# EAGLE design gateway_r0 (EAGLE 8.1.1)
DESCRIPTION: microOBD 200 OBD-II Module; HW_REV: 1.4; PCB_REV: C; PCB_SPEC1: Layer Count: 4; PCB_SPEC2: Size: 1.3" x 0.59"; PCB_SPEC3: Finish Thickness: 0.049" - 0.052"; PCB_SPEC4: Copper Weight: 1oz; TITLE: STM1120
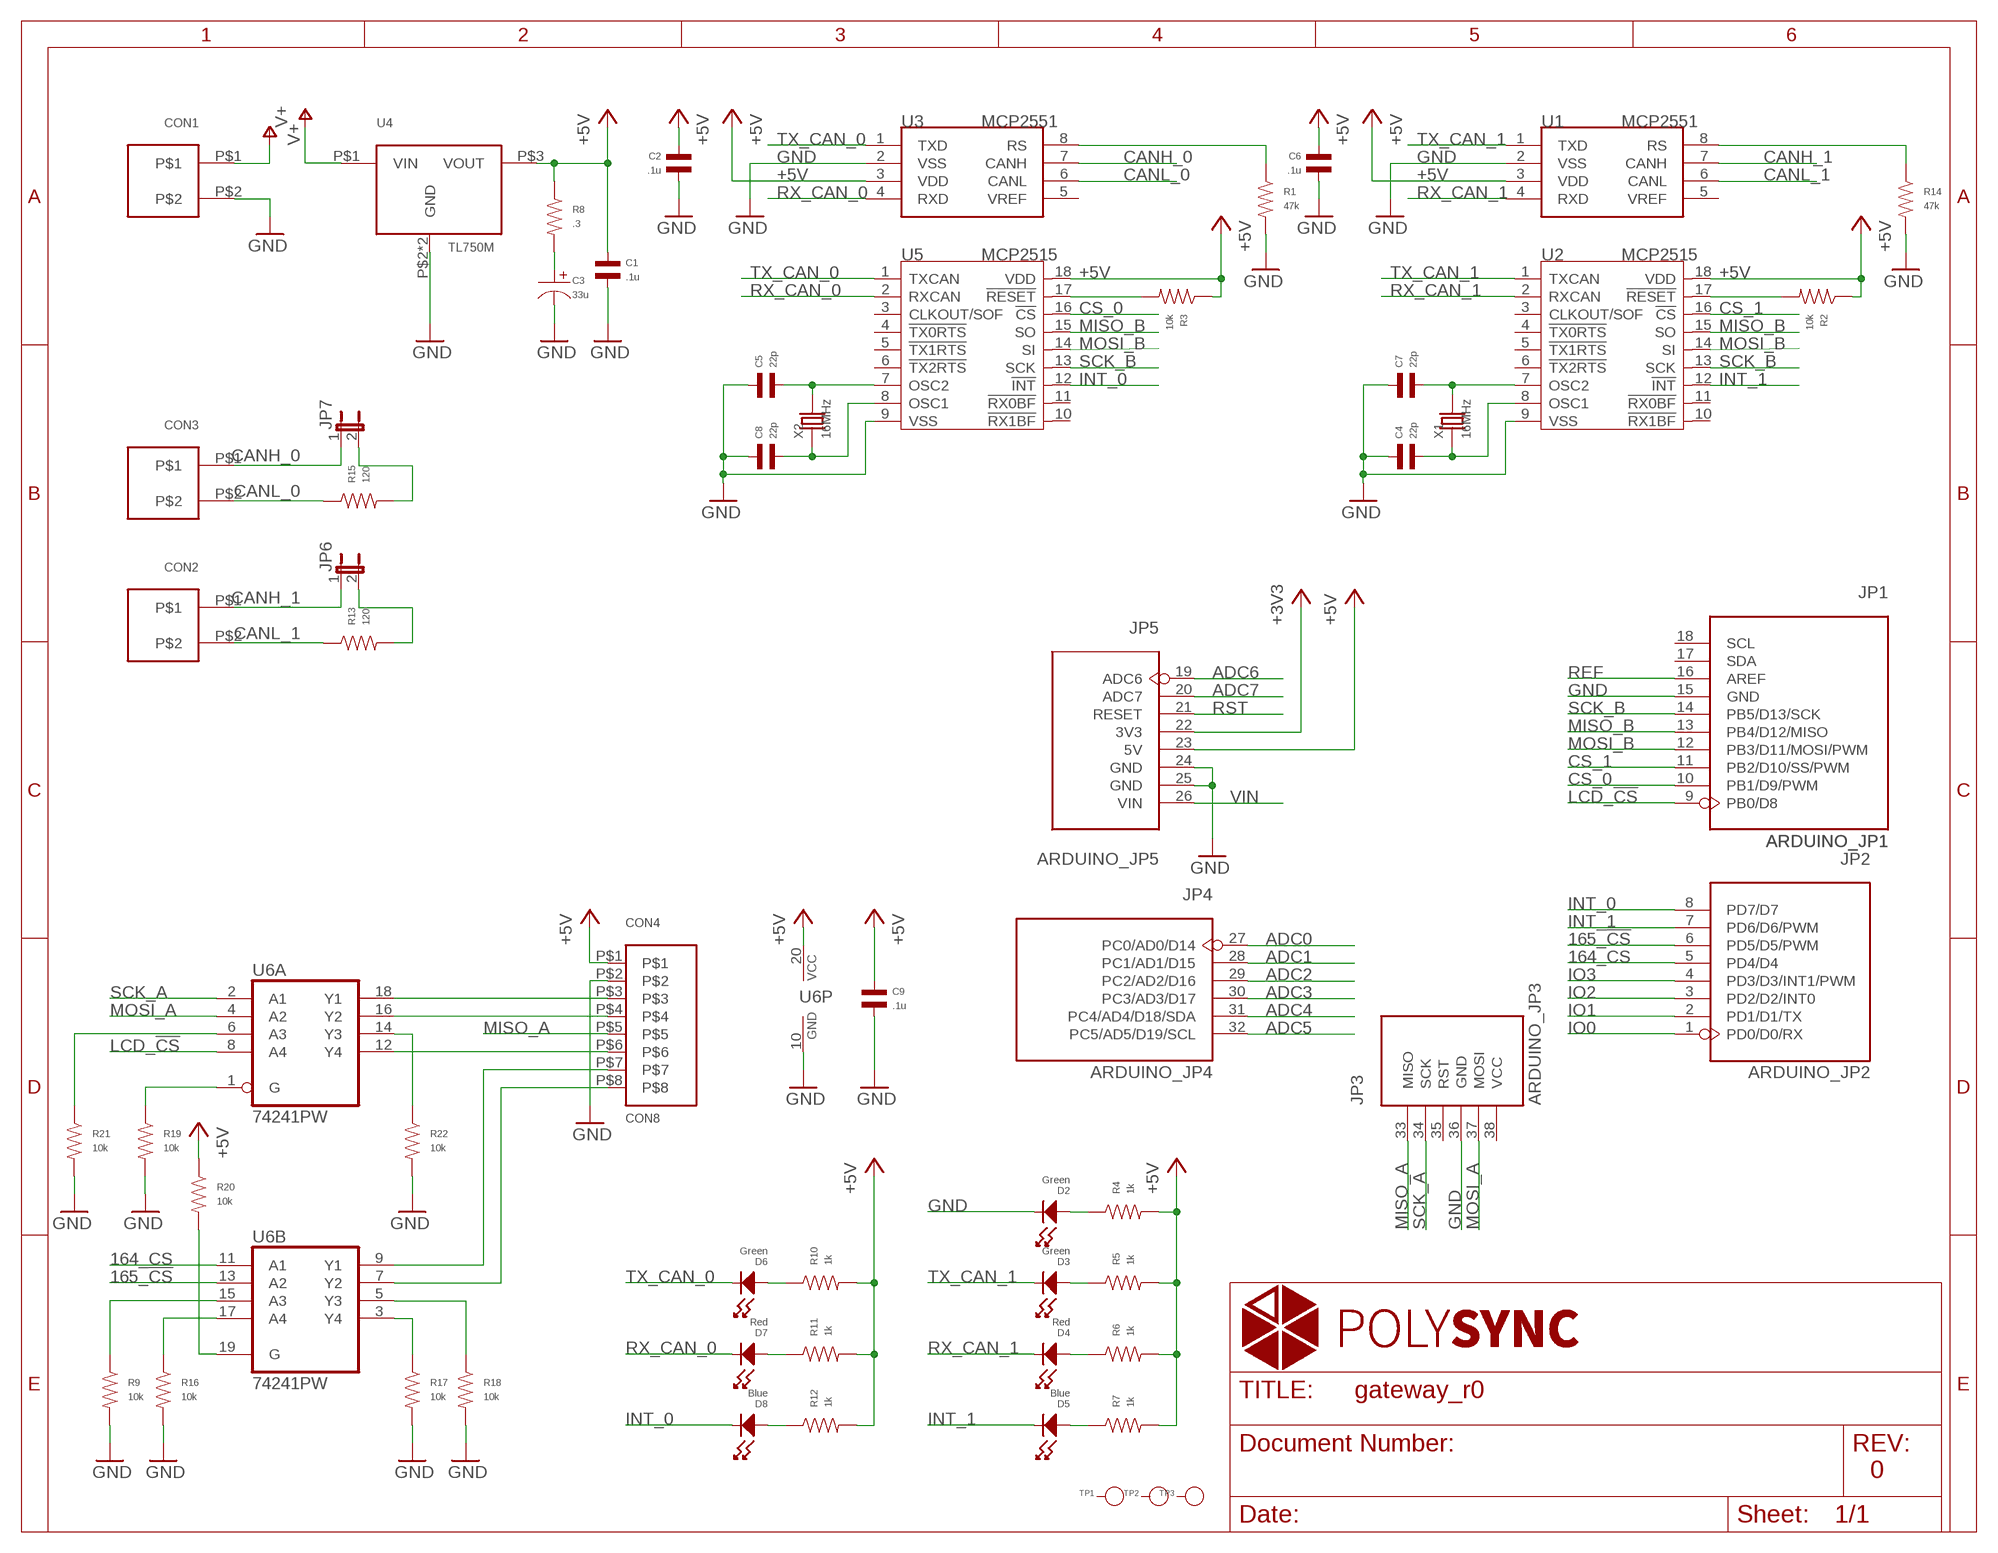
[diagram p0: schematic, sheet 1]

## Parts
C1  .1u  CAPACITOR_NP_0402  [C0402]
C2  .1u  CAPACITOR_NP_0402  [C0402]
C3  33u  CAPACITOR_P  [CP1206]
C4  22p  CAPACITOR_NP_0402  [C0402]
C5  22p  CAPACITOR_NP_0402  [C0402]
C6  .1u  CAPACITOR_NP_0402  [C0402]
C7  22p  CAPACITOR_NP_0402  [C0402]
C8  22p  CAPACITOR_NP_0402  [C0402]
C9  .1u  CAPACITOR_NP_0402  [C0402]
CON1  CON23.5MM  [PHOENIX_2_45]
CON2  CON23.5MM  [PHOENIX_2_45]
CON3  CON23.5MM  [PHOENIX_2_45]
CON4  CON8  [PH-8-SM]
D2  Green  LED_SINGLE-0603  [LED0603]
D3  Green  LED_SINGLE-0603  [LED0603]
D4  Red  LED_SINGLE-0603  [LED0603]
D5  Blue  LED_SINGLE-0603  [LED0603]
D6  Green  LED_SINGLE-0603  [LED0603]
D7  Red  LED_SINGLE-0603  [LED0603]
D8  Blue  LED_SINGLE-0603  [LED0603]
JP1  ARDUINO_JP1  [ARDUINO_JP1]
JP2  ARDUINO_JP2  [ARDUINO_JP2]
JP3  ARDUINO_JP3  [ARDUINO_JP3]
JP4  ARDUINO_JP4  [ARDUINO_JP4]
JP5  ARDUINO_JP5  [ARDUINO_JP5]
JP6  JP1E  [JP1]
JP7  JP1E  [JP1]
R1  47k  RESISTOR_0402  [R0402]
R2  10k  RESISTOR_0402  [R0402]
R3  10k  RESISTOR_0402  [R0402]
R4  1k  RESISTOR_0402  [R0402]
R5  1k  RESISTOR_0402  [R0402]
R6  1k  RESISTOR_0402  [R0402]
R7  1k  RESISTOR_0402  [R0402]
R8  .3  RESISTOR_0402  [R0402]
R9  10k  RESISTOR_0402  [R0402]
R10  1k  RESISTOR_0402  [R0402]
R11  1k  RESISTOR_0402  [R0402]
R12  1k  RESISTOR_0402  [R0402]
R13  120  RESISTOR_0402  [R0402]
R14  47k  RESISTOR_0402  [R0402]
R15  120  RESISTOR_0402  [R0402]
R16  10k  RESISTOR_0402  [R0402]
R17  10k  RESISTOR_0402  [R0402]
R18  10k  RESISTOR_0402  [R0402]
R19  10k  RESISTOR_0402  [R0402]
R20  10k  RESISTOR_0402  [R0402]
R21  10k  RESISTOR_0402  [R0402]
R22  10k  RESISTOR_0402  [R0402]
TP1  PAD-TEST-POINT'4545'  [TP_4545]
TP2  PAD-TEST-POINT'4545'  [TP_4545]
TP3  PAD-TEST-POINT'4545'  [TP_4545]
U1  MCP2551  MCP2551-SOIC8  [SOIC8-6.0]
U2  MCP2515  MCP2515-SOIC18  [SOIC18]
U3  MCP2551  MCP2551-SOIC8  [SOIC8-6.0]
U4  TL750M  [TO-263]
U5  MCP2515  MCP2515-SOIC18  [SOIC18]
U6  74241PW  [PW_R-PDSO-G20]
X1  16MHz  CRYSTAL-HC49UP  [HC49UP]
X2  16MHz  CRYSTAL-HC49UP  [HC49UP]

## Nets
164_CS: JP2.5(PD4/D4) U6.11(B:A1)
165_!CS: JP2.6(PD5/D5/PWM) U6.13(B:A2)
+3V3: JP5.22(3V3)
+5V: C1.P$1 C2.P$1 C6.P$1 C9.P$1 CON4.P$1 JP5.23(5V) R2.P$1 R3.P$1 R4.P$2 R5.P$2 R6.P$2 R7.P$2 R8.P$1 R10.P$2 R11.P$2 R12.P$2 R20.P$1 U1.3(VDD) U2.18(VDD) U3.3(VDD) U4.P$3(VOUT) U5.18(VDD) U6.20(P:VCC)
ADC0: JP4.27(PC0/AD0/D14)
ADC1: JP4.28(PC1/AD1/D15)
ADC2: JP4.29(PC2/AD2/D16)
ADC3: JP4.30(PC3/AD3/D17)
ADC4: JP4.31(PC4/AD4/D18/SDA)
ADC5: JP4.32(PC5/AD5/D19/SCL)
ADC6: JP5.19(ADC6)
ADC7: JP5.20(ADC7)
CANH_0: CON3.P$1 JP7.1 U3.7(CANH)
CANH_1: CON2.P$1 JP6.1 U1.7(CANH)
CANL_0: CON3.P$2 R15.P$1 U3.6(CANL)
CANL_1: CON2.P$2 R13.P$1 U1.6(CANL)
CS_0: JP1.10(PB1/D9/PWM) U5.16(!CS)
CS_1: JP1.11(PB2/D10/SS/PWM) U2.16(!CS)
GND: C1.P$2 C2.P$2 C3.P$2 C4.P$1 C5.P$1 C6.P$2 C7.P$1 C8.P$1 C9.P$2 CON1.P$2 CON4.P$2 D2.CATHODE JP1.15(GND) JP3.36(GND) JP5.24(GND) JP5.25(GND) R1.P$2 R9.P$2 R14.P$2 R16.P$2 R17.P$2 R18.P$2 R19.P$2 R21.P$2 R22.P$2 U1.2(VSS) U2.9(VSS) U3.2(VSS) U4.P$2(GND) U4.P$4(GND) U5.9(VSS) U6.10(P:GND)
INT_0: D8.CATHODE JP2.8(PD7/D7) U5.12(!INT)
INT_1: D5.CATHODE JP2.7(PD6/D6/PWM) U2.12(!INT)
IO0: JP2.1(PD0/D0/RX)
IO1: JP2.2(PD1/D1/TX)
IO2: JP2.3(PD2/D2/INT0)
IO3: JP2.4(PD3/D3/INT1/PWM)
LCD_!CS: JP1.9(PB0/D8) U6.8(A:A4)
MISO_A: CON4.P$5 JP3.33(MISO)
MISO_B: JP1.13(PB4/D12/MISO) U2.15(SO) U5.15(SO)
MOSI_A: JP3.37(MOSI) U6.4(A:A2)
MOSI_B: JP1.12(PB3/D11/MOSI/PWM) U2.14(SI) U5.14(SI)
N$1: D3.ANODE R5.P$1
N$2: JP6.2 R13.P$2
N$3: C5.P$2 U5.7(OSC2) X2.2
N$4: C3.P$1 R8.P$2
N$5: D4.ANODE R6.P$1
N$6: D2.ANODE R4.P$1
N$7: C8.P$2 U5.8(OSC1) X2.1
N$8: D5.ANODE R7.P$1
N$9: R14.P$1 U1.8(RS)
N$10: R1.P$1 U3.8(RS)
N$11: CON4.P$3 U6.18(A:Y1)
N$12: D6.ANODE R10.P$1
N$13: D7.ANODE R11.P$1
N$14: D8.ANODE R12.P$1
N$15: JP7.2 R15.P$2
N$16: C7.P$2 U2.7(OSC2) X1.2
N$17: C4.P$2 U2.8(OSC1) X1.1
N$18: CON4.P$4 U6.16(A:Y2)
N$19: R21.P$1 U6.6(A:A3)
N$20: CON4.P$6 U6.12(A:Y4)
N$21: CON4.P$7 U6.9(B:Y1)
N$22: CON4.P$8 U6.7(B:Y2)
N$23: R9.P$1 U6.15(B:A3)
N$24: R16.P$1 U6.17(B:A4)
N$25: R17.P$1 U6.3(B:Y4)
N$26: R18.P$1 U6.5(B:Y3)
N$27: R19.P$1 U6.1(A:G)
N$28: R20.P$2 U6.19(B:G)
N$29: R22.P$1 U6.14(A:Y3)
REF: JP1.16(AREF)
RST: JP5.21(RESET)
RST_N: R2.P$2 U2.17(!RESET)
RST_N1: R3.P$2 U5.17(!RESET)
RX_CAN_0: D7.CATHODE U3.4(RXD) U5.2(RXCAN)
RX_CAN_1: D4.CATHODE U1.4(RXD) U2.2(RXCAN)
SCK_A: JP3.34(SCK) U6.2(A:A1)
SCK_B: JP1.14(PB5/D13/SCK) U2.13(SCK) U5.13(SCK)
TX_CAN_0: D6.CATHODE U3.1(TXD) U5.1(TXCAN)
TX_CAN_1: D3.CATHODE U1.1(TXD) U2.1(TXCAN)
V+: CON1.P$1 U4.P$1(VIN)
VIN: JP5.26(VIN)
Unconnected: JP1.17(SDA) JP1.18(SCL) JP3.35(RST) JP3.38(VCC) TP1.T TP2.T TP3.T U1.5(VREF) U2.3(CLKOUT/SOF) U2.4(!TX0RTS) U2.5(!TX1RTS) U2.6(!TX2RTS) U2.10(!RX1BF) U2.11(!RX0BF) U3.5(VREF) U5.3(CLKOUT/SOF) U5.4(!TX0RTS) U5.5(!TX1RTS) U5.6(!TX2RTS) U5.10(!RX1BF) U5.11(!RX0BF)

## Notes on the sheet
- 0

## Library data of the parts
C1 C2 C4-C9 = MF_Passives:CAPACITOR_NP: Library: MF_Passives Description: Device for Non-Polarized Capacitors. Manufacture part number (MPN) can be added via Attributes. Check https://factory.macrofab.com/parts for the house parts list.; POPULATE: 1
C3 = MF_Passives:CAPACITOR_P: Library: MF_Passives Description: Device for Polarized Capacitors. Manufacture part number (MPN), Voltage Rating, and Tolerance can be added via Attributes. Check https://factory.macrofab.com/parts for the house parts list.
CON1-CON3 = polysync:CON2
CON4 = polysync:CON8
D2-D8 = MF_LEDs:LED_SINGLE: Library: MF_LEDs Description: Device for Single LED Packages. Manufacture part number (MFG#) can be added via Attributes.; HOUSEPART: NO; POPULATE: 1
JP1 = polysync_steering_throttle:ARDUINO_JP1
JP2 = polysync_steering_throttle:ARDUINO_JP2
JP3 = polysync_steering_throttle:ARDUINO_JP3
JP4 = polysync_steering_throttle:ARDUINO_JP4
JP5 = polysync_steering_throttle:ARDUINO_JP5
JP6 JP7 = jumper:JP1E: JUMPER
R1-R22 = MF_Passives:RESISTOR: Library: MF_Passives Description: Device for Resistors. Manufacture part number (MPN), Voltage, Tolerance, and Wattage Rating can be added via Attributes. Check https://factory.macrofab.com/parts for the house parts list.; POPULATE: 1
TP1-TP3 = Discrete:PAD-TEST-POINT; PARTNO: DNP
U1 U3 = IC:MCP2551: High-Speed CAN Transceiver http://ww1.microchip.com/downloads/en/devicedoc/21667f.pdf
U2 U5 = IC:MCP2515: Stand-Alone CAN Controller With SPI Interface
U4 = polysync:TL750M
U6 = polysync:74*241: Octal BUFFER and LINE DRIVER, 3-state
X1 X2 = Discrete:CRYSTAL*: CRYSTAL

## Net classes
0 default: width 0.152 mm, drill 0.305 mm, clearance 0.152 mm

## Board
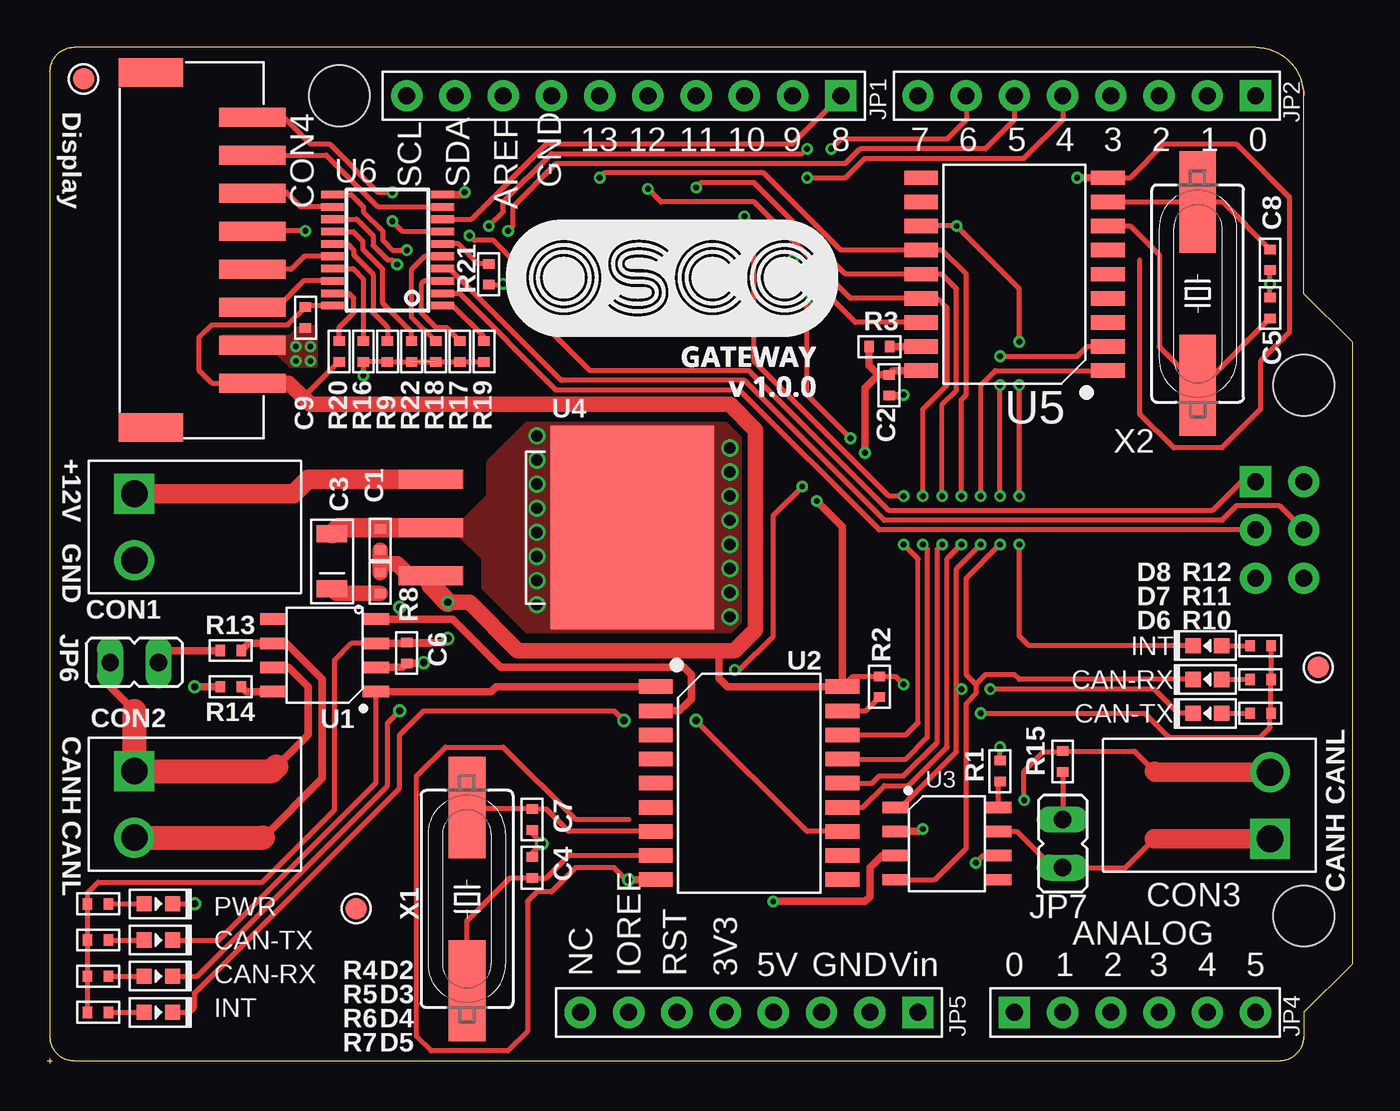
[diagram p1: board, top side]
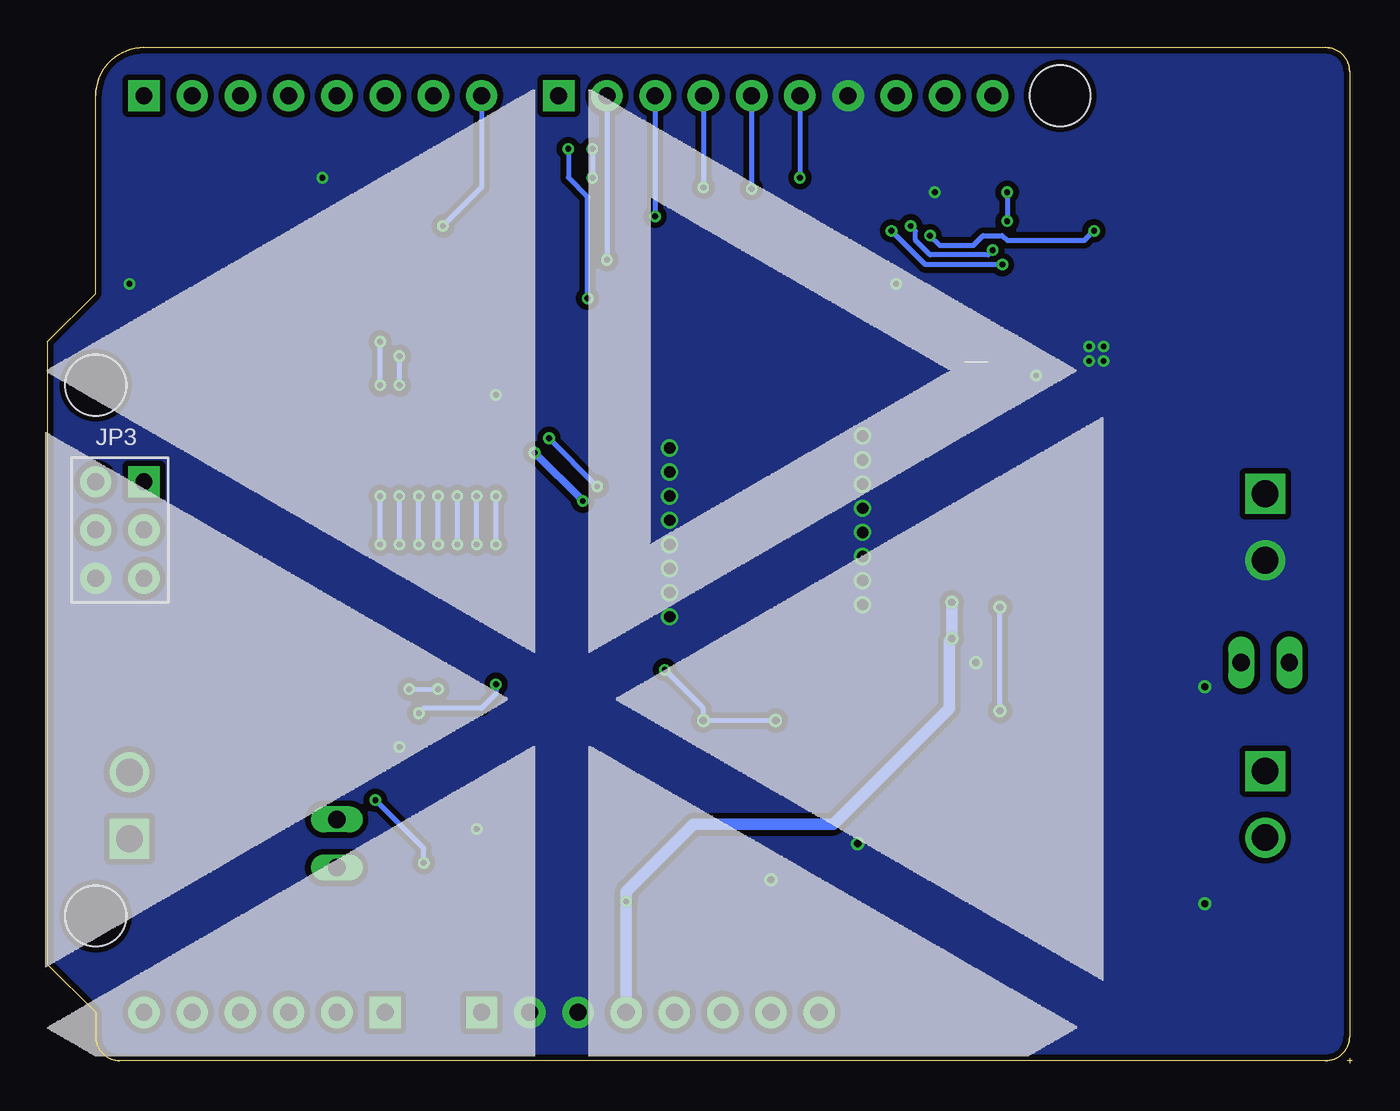
[diagram p2: board, bottom side, seen from below]

Size 68.71 x 53.47 mm. Coordinates in mm from the lower left corner, seen from the top.
Outline: 66.17,1.4 arc-90 64.9,0.13
Outline: 1.4,0.13 arc-90 0.13,1.4
Outline: 0.13,52.2 arc-90 1.4,53.47
Outline: 63.63,53.47 arc-90 66.17,50.93
Outline: 0.13,1.4 arc90 1.4,0.13
Outline: 64.9,0.13 arc90 66.17,1.4
Outline: 1.4,53.47 arc90 0.13,52.2
Outline: 0.13,1.4 arc90 1.4,0.13
Outline: 64.9,0.13 arc90 66.17,1.4
Outline: 66.17,50.93 arc90 63.63,53.47
Outline: 66.17,1.4 66.17,2.67 68.71,5.21 68.71,37.97 66.17,40.51 66.17,50.93
Outline: 66.17,1.4 arc-90 64.9,0.13
Outline: 63.63,53.47 1.4,53.47
Outline: 1.4,53.47 arc90 0.13,52.2
Outline: 0.13,52.2 0.13,1.4
Outline: 0.13,1.4 arc90 1.4,0.13
Outline: 66.17,50.93 arc90 63.63,53.47
Outline: 1.4,0.13 64.9,0.13
Outline: 0,0.13 0.25,0.13
Outline: 0.13,0.25 0.13,0
Copper layers (1*16): Top 0.035mm / dielectric 1.5mm / Bottom 0.035mm
Design rules "MF_Standard_2_Layer": minimum track width 6mil, minimum drill 12mil, track to track 6mil, track to pad 6mil, pad to pad 6mil, via to via 6mil, smd to smd 0mil, copper to edge 10mil, drill to drill 10mil, minimum pad ring 6mil, minimum via ring 6mil, stop-mask expansion 2mil, vias tented up to drill 25mil, thermal gap 10mil

### Footprints (pad centres in the part's own frame; a part is rotated, then mirrored left to right if it is on the bottom)
C0402 = smd 0.5 x 0.6: P$1 -0.55,0; P$2 0.55,0
CP1206 = smd 0.9 x 1.6: P$1 -1.45,0; P$2 1.45,0
PHOENIX_2_45 = drill 1.4 square: P$1 0,0 | drill 1.4: P$2 3.5,0
PH-8-SM = smd 1.5 x 3.4: MT1 -9.35,5.35; MT2 9.35,5.35 | smd 1 x 3.5: P$1 -7,0; P$2 -5,0; P$3 -3,0; P$4 -1,0; P$5 1,0; P$6 3,0; P$7 5,0; P$8 7,0
LED0603 = smd 0.8 x 0.8: ANODE 0.75,0; CATHODE -0.75,0
ARDUINO_JP1 = drill 0.889 pad 1.651 square: 9 41.656,50.8 | drill 0.889 pad 1.651: 10 39.116,50.8; 11 36.576,50.8; 12 34.036,50.8; 13 31.496,50.8; 14 28.956,50.8; 15 26.416,50.8; 16 23.876,50.8; 17 21.336,50.8; 18 18.796,50.8 | hole 3.2: 15.24,50.8
ARDUINO_JP2 = drill 0.889 pad 1.651 square: 1 63.5,50.8 | drill 0.889 pad 1.651: 2 60.96,50.8; 3 58.42,50.8; 4 55.88,50.8; 5 53.34,50.8; 6 50.8,50.8; 7 48.26,50.8; 8 45.72,50.8
ARDUINO_JP3 = drill 0.889 pad 1.651 square: 33 63.5,30.48 | drill 0.889 pad 1.651: 34 63.5,27.94; 35 63.5,25.4; 36 66.04,25.4; 37 66.04,27.94; 38 66.04,30.48 | hole 3.2: 66.04,35.56; 66.04,7.62
ARDUINO_JP4 = drill 0.889 pad 1.651 square: 27 50.8,2.54 | drill 0.889 pad 1.651: 28 53.34,2.54; 29 55.88,2.54; 30 58.42,2.54; 31 60.96,2.54; 32 63.5,2.54
ARDUINO_JP5 = drill 0.889 pad 1.651: 19 27.94,2.54; 20 30.48,2.54; 21 33.02,2.54; 22 35.56,2.54; 23 38.1,2.54; 24 40.64,2.54; 25 43.18,2.54 | drill 0.889 pad 1.651 square: 26 45.72,2.54
JP1 = drill 0.914 long: 1 0,-1.27; 2 0,1.27
R0402 = smd 0.5 x 0.6: P$1 -0.55,0; P$2 0.55,0
TP_4545 = smd 1.143 x 1.143: T 0,0
SOIC8-6.0 = smd 0.6 x 1.4: 1 -1.905,-2.7; 2 -0.635,-2.7; 3 0.635,-2.7; 4 1.905,-2.7; 5 1.905,2.7; 6 0.635,2.7; 7 -0.635,2.7; 8 -1.905,2.7
SOIC18 = smd 0.762 x 1.778: 1 -5.08,-4.915; 2 -3.81,-4.915; 3 -2.54,-4.915; 4 -1.27,-4.915; 5 0,-4.915; 6 1.27,-4.915; 7 2.54,-4.915; 8 3.81,-4.915; 9 5.08,-4.915; 10 5.08,4.915; 11 3.81,4.915; 12 2.54,4.915; 13 1.27,4.915; 14 0,4.915; 15 -1.27,4.915; 16 -2.54,4.915; 17 -3.81,4.915; 18 -5.08,4.915
TO-263 = smd 1 x 3.4: P$1 -2.54,0; P$2 0,0; P$3 2.54,0 | smd 10.7 x 8.6: P$4 0,10.6
PW_R-PDSO-G20 = smd 0.4 x 1.2: 1 -2.925,-2.9; 2 -2.275,-2.9; 3 -1.625,-2.9; 4 -0.975,-2.9; 5 -0.325,-2.9; 6 0.325,-2.9; 7 0.975,-2.9; 8 1.625,-2.9; 9 2.275,-2.9; 10 2.925,-2.9; 11 2.925,2.9; 12 2.275,2.9; 13 1.625,2.9; 14 0.975,2.9; 15 0.325,2.9; 16 -0.325,2.9; 17 -0.975,2.9; 18 -1.625,2.9; 19 -2.275,2.9; 20 -2.925,2.9
HC49UP = smd 5.334 x 1.93: 1 -4.826,0; 2 4.826,0

### Placement (x,y rotation side)
C1  17.53,27.56 90 top
C2  44.32,35.69 270 top
C3  14.99,26.42 90 top
C4  25.53,10.29 270 top
C5  64.39,39.75 270 top
C6  18.92,21.59 270 top
C7  25.53,12.83 90 top
C8  64.39,42.29 90 top
C9  13.59,39.24 270 top
CON1  4.57,29.97 270 top
CON2  4.57,15.37 270 top
CON3  64.39,11.81 90 top
CON4  10.79,42.8 90 top
D2  5.84,8.38 180 top
D3  5.84,6.48 180 top
D4  5.84,4.57 180 top
D5  5.84,2.67 180 top
D6  61.09,18.41 0 top
D7  61.09,20.19 0 top
D8  61.09,21.97 0 top
JP1  0.13,0.13 0 top
JP2  0.13,0.13 0 top
JP3  0.13,0.13 0 top
JP4  0.13,0.13 0 top
JP5  0.13,0.13 0 top
JP6  4.57,21.08 270 top
JP7  53.47,11.56 0 top
R1  50.16,15.37 90 top
R2  43.82,19.81 270 top
R3  43.82,37.72 0 top
R4  2.67,8.38 180 top
R5  2.67,6.48 180 top
R6  2.67,4.57 180 top
R7  2.67,2.67 180 top
R8  17.53,25.27 270 top
R9  17.91,37.47 270 top
R10  63.88,18.41 0 top
R11  63.88,20.19 0 top
R12  63.88,21.97 0 top
R13  9.65,21.72 180 top
R14  9.65,19.81 180 top
R15  53.47,15.88 270 top
R16  16.64,37.47 270 top
R17  21.72,37.47 270 top
R18  20.45,37.47 270 top
R19  22.99,37.47 270 top
R20  15.37,37.47 90 top
R21  23.24,41.53 270 top
R22  19.18,37.47 270 top
TP1  16.26,8.13 0 top
TP2  66.93,20.83 0 top
TP3  1.91,51.82 0 top
U1  14.61,21.46 90 top
U2  36.96,14.73 270 top
U3  47.37,11.56 270 top
U4  20.19,28.19 270 top
U5  50.93,41.53 90 top
U6  17.91,42.8 90 top
U$1  [POLYSYNC_STEERING_BOT]  0.64,0.38 0 top
U$2  [POLYSYNC_GATEWAY_1_0_0]  24,34.67 0 top
X1  22.1,8.64 90 top
X2  60.58,40.51 270 top

### Tracks (layer width: path | path; a pad name or v marks a point on that pad's centre or on a via)
164_CS  (via drill 0.3)
  Top 0.254: JP2.5 53.47,49.66 51.44,47.62 43.05,47.62 42.04,46.61 v40.01,46.61 | U6.11 16,45.72 16.64,45.09 16.64,44.83 17.65,43.82 17.65,43.31 18.16,42.8 v18.92,42.8 | v23.24,44.07 24,44.83 24,45.34 26.54,47.88 39.75,47.88 v40.01,48.13
  Bottom 0.254: v40.01,48.13 v40.01,46.61 | v18.92,42.8 19.18,42.55 22.22,42.55 22.99,43.31 22.99,43.82 v23.24,44.07
165_!CS  (via drill 0.3)
  Top 0.254: JP2.6 50.93,49.66 49.4,48.13 42.8,48.13 42.04,47.37 26.8,47.37 24.51,45.09 24.51,44.07 v24.26,43.82 | v18.41,42.04 18.16,42.29 17.91,42.29 17.14,43.05 17.14,43.56 16.28,44.42 U6.13
  Bottom 0.254: v18.41,42.04 22.48,42.04 v24.26,43.82
+5V  (via drill 0.3, 0.38)
  Top 0.254: R7.P$2 R6.P$2 R5.P$2 R4.P$2 2.12,8.98 2.67,9.53 11.3,9.53 15.11,13.34 15.11,21.21 16,22.1 U1.3 | R8.P$1 17.53,26.16 17.65,26.29 | U6.20 13.67,39.87 C9.P$1 12.66,38.86 8.64,38.86 8,38.23 8,36.45 8.65,35.8 CON4.P$1 10.94,35.94 | R20.P$1 15.33,36.91 13.46,35.05 | R12.P$2 R11.P$2 R10.P$2 64.39,18.37 64.39,17.65 63.88,17.14 59.05,17.14 57.79,18.41 v49.15,18.41 | v45.09,19.94 44.66,20.36 R2.P$1 42.42,20.36 U2.18
  Top 0.406: U1.3 20.15,22.1 C6.P$1 20.87,22.14 v21.08,22.35 | U3.3 43.94,10.92 43.31,10.29 43.31,8.76 43.05,8.51 v38.23,8.51 | U5.18 44.54,36.45 C2.P$1 43.77,36.24 | R3.P$1 43.27,36.75 43.77,36.24 | v40.51,29.59 41.87,28.23 U2.18 35.81,19.81 35.37,20.26 35.37,21.53 35.18,21.72 | v43.05,32.13 43.05,35.52 43.77,36.24
  Top 0.813: C1.P$1 R8.P$1 | U4.P$3 19.05,25.65 18.41,26.29 17.65,26.29 | v21.08,24.26 22.22,24.26 24.77,21.72 35.18,21.72 36.2,21.72 37.29,22.81 37.29,33.33 35.94,34.67 13.84,34.67 13.46,35.05 12.71,35.8 CON4.P$1
  Top 1.016: U4.P$3 20.19,25.15 v21.08,24.26
  Bottom 0.254: v45.09,19.94 45.09,19.43 45.85,18.67 48.9,18.67 v49.15,18.41
  Bottom 0.406: v40.51,29.59 v43.05,32.13
  Bottom 0.61: JP5.23 v38.23,8.51 38.23,9.02 34.67,12.57 27.3,12.57 21.21,18.67 21.21,22.22 v21.08,22.35 v21.08,24.26
CANH_0
  Top 0.254: 58.29,11.81 56.77,10.29 JP7.1 53.21,10.54 52.71,10.54 51.05,12.19 U3.7
  Top 1.016: 58.29,11.81 CON3.P$1
CANH_1
  Top 0.406: 11.81,15.37 12.07,15.62 13.72,17.27 13.72,19.81 12.7,20.83 U1.7 | JP6.1 3.3,19.81 4.57,18.54
  Top 1.27: 12.07,15.62 11.81,15.37 CON2.P$1 4.57,18.54
CANL_0  (via drill 0.3)
  Top 0.254: 58.29,15.37 57.23,16.42 R15.P$1 53.43,16.38 52.45,16.38 51.44,15.37 v51.44,13.84 | U3.6 49.28,10.92 v48.9,10.54
  Top 1.016: CON3.P$2 58.35,15.31 58.29,15.37
  Bottom 0.254: v48.9,10.54 48.9,11.3 v51.44,13.84
CANL_1
  Top 0.406: 11.36,11.87 14.48,14.99 14.48,20.19 12.57,22.1 U1.6 10.58,22.1 R13.P$1
  Top 1.27: CON2.P$2 11.36,11.87
CS_0  (via drill 0.3)
  Top 0.254: U5.16 42.55,38.99 v39.24,42.29
  Bottom 0.254: JP1.10 v39.24,42.29
CS_1  (via drill 0.3)
  Top 0.254: U2.16 45.21,17.27 45.85,17.91 45.85,26.54 v45.09,27.3 | v45.09,29.84 44.32,29.84 37.21,36.96 37.21,44.07 v36.7,44.58
  Bottom 0.254: v45.09,27.3 v45.09,29.84 | JP1.11 v36.7,44.58
GND  (via drill 0.3, 0.38, 0.6)  (1 unrouted)
  Top 0.254: D2.CATHODE v7.75,8.38 | 19.77,21.04 v19.81,21.08 | C7.P$1 25.53,12.07 v26.04,11.56 25.53,11.05 C4.P$1 | v30.61,9.65 30.48,9.65 29.84,10.29 27.81,10.29 26.54,9.02 25.78,9.02 25.27,8.51 25.27,1.65 24.26,0.64 20.19,0.64 19.43,1.4 19.43,15.11 20.95,16.64 24,16.64 27.81,12.83 30.61,12.83 | R19.P$2 R17.P$2 R18.P$2 R9.P$2 R16.P$2 v16.64,36.2 | C1.P$2 17.48,28.11 17.4,28.19 | C8.P$1 v64.39,41.02 C5.P$1 | 57.53,42.29 57.53,34.16 59.31,32.39 61.85,32.39 63.88,34.42 63.88,36.96 65.41,38.48 65.41,45.59 62.61,48.39 58.8,48.39 57.02,46.61 U5.9 | R1.P$2 v50.16,16.64 | R21.P$2 23.96,40.98 v24,41.02
  Top 0.406: R14.P$2 v7.75,19.81 | 19.77,21.04 C6.P$2 18.71,20.83 U1.2 | U2.9 v30.61,9.65 | U6.10 21.85,45.72 v21.97,45.85 | U3.2 45.97,12.19 v46.1,12.32 | C2.P$2 45.04,35.14 v45.09,35.18 | v54.23,46.61 U5.9
  Top 1.016: U4.P$2 17.4,28.19 15.31,28.19 C3.P$2
  other vias: 35.94,32.39 35.94,31.11 35.94,29.84 35.94,28.57 35.94,27.3 35.94,26.04 35.94,24.77 35.94,23.49 25.78,33.02 25.78,31.75 25.78,30.48 25.78,29.21 25.78,27.94 25.78,26.67 25.78,25.4 25.78,24.13 13.08,37.72 13.84,37.72 13.08,36.96 13.84,36.96
  pour Bottom (isolate 0.305, no thermals): 0.13,53.47 0.13,0.13 68.71,0.13 68.71,53.47
  pour Top (isolate 0.305, no thermals): 9.27,38.23 12.83,38.23 13.34,38.73 14.1,38.73 14.1,36.7 12.83,36.7 12.32,37.21 12.07,37.47 9.27,37.47
  pour Top (isolate 0.305, no thermals): 18.67,28.57 21.97,28.57 23.24,29.84 23.24,31.62 25.27,33.66 35.69,33.66 36.45,32.89 36.45,23.24 35.94,22.73 25.27,22.73 22.99,25.02 22.99,26.54 21.72,27.81 18.67,27.81
INT_0  (via drill 0.3)
  Top 0.254: U5.12 v47.88,44.07 51.18,40.77 v51.18,37.97 | v51.18,27.3 51.18,22.48 51.69,21.97 D8.CATHODE | v51.18,29.84 v51.18,35.69
  Bottom 0.254: JP2.8 45.85,46.1 v47.88,44.07 | v51.18,27.3 v51.18,29.84 | v51.18,35.69 v51.18,37.97
INT_1  (via drill 0.3, 0.38)
  Top 0.254: v30.35,18.03 29.84,18.54 19.81,18.54 18.54,17.27 18.54,14.48 7.75,3.68 7.75,2.92 7.49,2.67 D5.CATHODE | JP2.7 48.39,49.66 47.37,48.64 41.78,48.64 v41.28,48.13 | U2.12 40.01,12.19 v34.16,18.03 | v36.2,20.7 36.45,20.7 38.23,22.48 38.23,28.83 v39.75,30.35 | v42.29,32.89 40.01,35.18 40.01,40.01 v40.26,40.26
  Bottom 0.254: v30.35,18.03 v34.16,18.03 34.16,18.67 v36.2,20.7 | v39.75,30.35 v42.29,32.89 | v40.26,40.26 40.26,45.59 41.28,46.61 v41.28,48.13
LCD_!CS
  Top 0.254: U6.8 22.33,44.42 26.29,48.39 39.24,48.39 JP1.9
MISO_A  (via drill 0.3)
  Top 0.254: JP3.33 62.87,30.61 61.34,29.08 44.32,29.08 36.96,36.45 28.57,36.45 24.77,40.26 24.77,42.04 23.49,43.31 22.48,43.31 v22.22,43.56 | v13.59,43.82 10.81,43.82 CON4.P$5
  Bottom 0.254: v22.22,43.56 21.72,43.05 19.94,43.05 19.43,43.56 18.41,43.56 18.16,43.31 14.1,43.31 v13.59,43.82
MISO_B  (via drill 0.3)
  Top 0.254: U2.15 45.21,16 46.36,17.14 46.36,27.05 v46.1,27.3 | v46.1,29.84 46.1,34.42 47.37,35.69 47.37,39.75 46.86,40.26 U5.15 42.29,40.26 37.21,45.34 32.31,45.34 v31.62,46.03
  Bottom 0.254: JP1.13 v31.62,46.03 | v46.1,27.3 v46.1,29.84
MOSI_A
  Top 0.254: U6.4 21.17,41.82 27.05,35.94 36.7,35.94 44.07,28.57 61.85,28.57 62.61,29.34 64.9,29.34 JP3.37
MOSI_B  (via drill 0.3)
  Top 0.254: U2.14 43.43,14.73 43.82,15.11 45.09,15.11 46.86,16.89 46.86,27.05 v47.12,27.3 | U5.14 47.12,41.53 47.88,40.77 47.88,35.43 47.12,34.67 v47.12,29.84 | U5.14 46.01,41.62 45.85,41.78 | U5.14 42.04,41.53 37.21,46.36 34.42,46.36 v34.16,46.1
  Bottom 0.254: JP1.12 v34.16,46.1 | v47.12,27.3 v47.12,29.84
N$1
  Top 0.254: R5.P$1 D3.ANODE
N$2
  Top 0.406: R13.P$2 6.48,21.72 JP6.2
N$3
  Top 0.254: U5.7 57.02,44.07 58.55,42.55 58.55,37.72 X2.2 60.88,35.69 C5.P$2
N$4
  Top 0.813: R8.P$2 15.23,24.72 C3.P$1
N$5
  Top 0.254: R6.P$1 D4.ANODE
N$6
  Top 0.254: R4.P$1 D2.ANODE
N$7
  Top 0.254: C8.P$2 61.89,45.34 X2.1 U5.8
N$8
  Top 0.254: R7.P$1 D5.ANODE
N$9
  Top 0.406: U1.8 10.46,19.56 R14.P$1
N$10
  Top 0.254: U3.8 50.07,14.72 R1.P$1
N$11
  Top 0.254: U6.18 13.49,41.17 12.07,39.75 10.84,39.75 CON4.P$3
N$12
  Top 0.254: D6.ANODE R10.P$1
N$13
  Top 0.254: D7.ANODE R11.P$1
N$14
  Top 0.254: D8.ANODE R12.P$1
N$15
  Top 0.254: R15.P$2 JP7.2
N$16
  Top 0.254: U2.7 27.43,12.19 26.25,13.38 C7.P$2 22.18,13.38 X1.2
N$17
  Top 0.254: U2.8 27.43,10.92 26.25,9.74 C4.P$2 24.34,9.74 22.1,7.49 X1.1
N$18
  Top 0.254: U6.16 13.52,42.47 12.83,41.78 11.56,41.78 11.3,41.53 11.07,41.53 CON4.P$4
N$19
  Top 0.254: U6.6 21.65,43.12 22.69,42.08 R21.P$1
N$20
  Top 0.254: U6.12 13.35,45.07 12.57,45.85 10.84,45.85 CON4.P$6
N$21
  Top 0.254: CON4.P$7 14.69,47.8 17.4,45.09 20.03,45.09 U6.9
N$22  (via drill 0.3)
  Top 0.254: CON4.P$8 12.43,49.8 13.84,48.39 14.86,48.39 17.4,45.85 v18.16,45.85 | U6.7 18.71,43.77 v18.16,44.32
  Bottom 0.254: v18.16,45.85 v18.16,44.32
N$23
  Top 0.254: U6.15 15.8,43.12 16.13,42.8 16.13,42.55 17.14,41.53 17.14,39.5 17.91,38.73 R9.P$1
N$24
  Top 0.254: U6.17 16.09,41.82 16.64,41.28 R16.P$1
N$25
  Top 0.254: U6.3 19.84,41.17 19.68,41.02 19.68,39.5 20.45,38.73 21,38.73 R17.P$1
N$26
  Top 0.254: U6.5 19.87,42.47 19.18,41.78 19.18,39.24 20.4,38.02 R18.P$1
N$27
  Top 0.254: U6.1 21.34,39.87 22.99,38.23 R19.P$1
N$28
  Top 0.254: U6.19 15.86,40.52 16.13,40.26 16.13,39.5 15.37,38.73 R20.P$2
N$29
  Top 0.254: U6.14 16.1,43.77 16.6,43.27 16.6,42.83 17.65,41.78 17.65,40.01 19.18,38.48 R22.P$1
RST_N
  Top 0.254: U2.17 43.1,18.54 R2.P$2
RST_N1
  Top 0.406: U5.17 R3.P$2
RX_CAN_0  (via drill 0.3)
  Top 0.254: U5.2 54.74,37.72 54.23,37.21 v50.16,37.21 | U3.4 46.74,9.65 48.39,11.3 48.39,18.92 48.9,19.43 48.9,19.94 | 48.9,19.94 48.39,20.45 48.39,25.53 v50.16,27.3 | 48.9,19.94 49.4,20.45 50.93,20.45 51.18,20.19 D7.CATHODE | v50.16,29.84 v50.16,35.69
  Bottom 0.254: v50.16,27.3 v50.16,29.84 | v50.16,35.69 v50.16,37.21
RX_CAN_1  (via drill 0.38)
  Top 0.254: v18.54,18.54 17.91,17.91 17.91,14.61 7.87,4.57 D4.CATHODE | v18.54,24 18.54,23.37
  Top 0.406: U1.4 18.54,23.37 21.34,23.37 23.88,20.83 33.53,20.83 33.91,20.45 33.91,19.18 33.66,18.92 33.27,18.54 U2.2
  Bottom 0.254: v18.54,18.54 v18.54,24
SCK_A
  Top 0.254: U6.2 21.71,40.52 26.8,35.43 36.45,35.43 43.82,28.07 JP3.34
SCK_B  (via drill 0.3)
  Top 0.254: U2.13 42.93,13.46 44.07,14.61 45.34,14.61 47.37,16.64 47.37,26.54 v48.13,27.3 | v48.13,29.84 48.13,34.93 48.39,35.18 48.39,41.53 47.12,42.8 U5.13 41.78,42.8 37.72,46.86 29.34,46.86 v29.08,46.61
  Bottom 0.254: JP1.14 v29.08,46.61 | v48.13,27.3 v48.13,29.84
TX_CAN_0  (via drill 0.3)
  Top 0.254: 55.75,36.45 U5.1 49.91,36.45 49.15,35.69 v49.15,29.84 | U3.1 44.96,13.46 47.88,16.38 47.88,19.43 | v49.15,27.3 47.88,26.04 47.88,19.43 | D6.CATHODE 59.56,18.41 58.29,19.68 v49.66,19.68 | 47.88,19.43 v48.13,19.68
  Bottom 0.254: v49.15,27.3 v49.15,29.84 | v49.66,19.68 v48.13,19.68
TX_CAN_1
  Top 0.254: D3.CATHODE 9.02,6.48 17.3,14.77 U1.1
  Top 0.406: U2.1 23.62,19.81 23.37,19.56 U1.1
V+
  Top 1.016: CON1.P$1 12.95,29.97 13.72,30.73 U4.P$1

### Text on the board
tPlace: Display | +12V | GND | INT | CAN-RX | CAN-TX | CANH | CANL | CANL | CANH | PWR | CAN-TX | CAN-RX | INT